# EasyEDA Pro project Complete_project.epro, schematic Schematic4

## Sheets
1 控制: Board Name: control2.0; Create Date: 2025-02-19; Page Name: 控制; Project Name: 煮茶机; Schematic Name: Schematic4; Update Date: 2025-02-22; Company: 嘉立创EDA; Page Size: A4; Version: V1.0
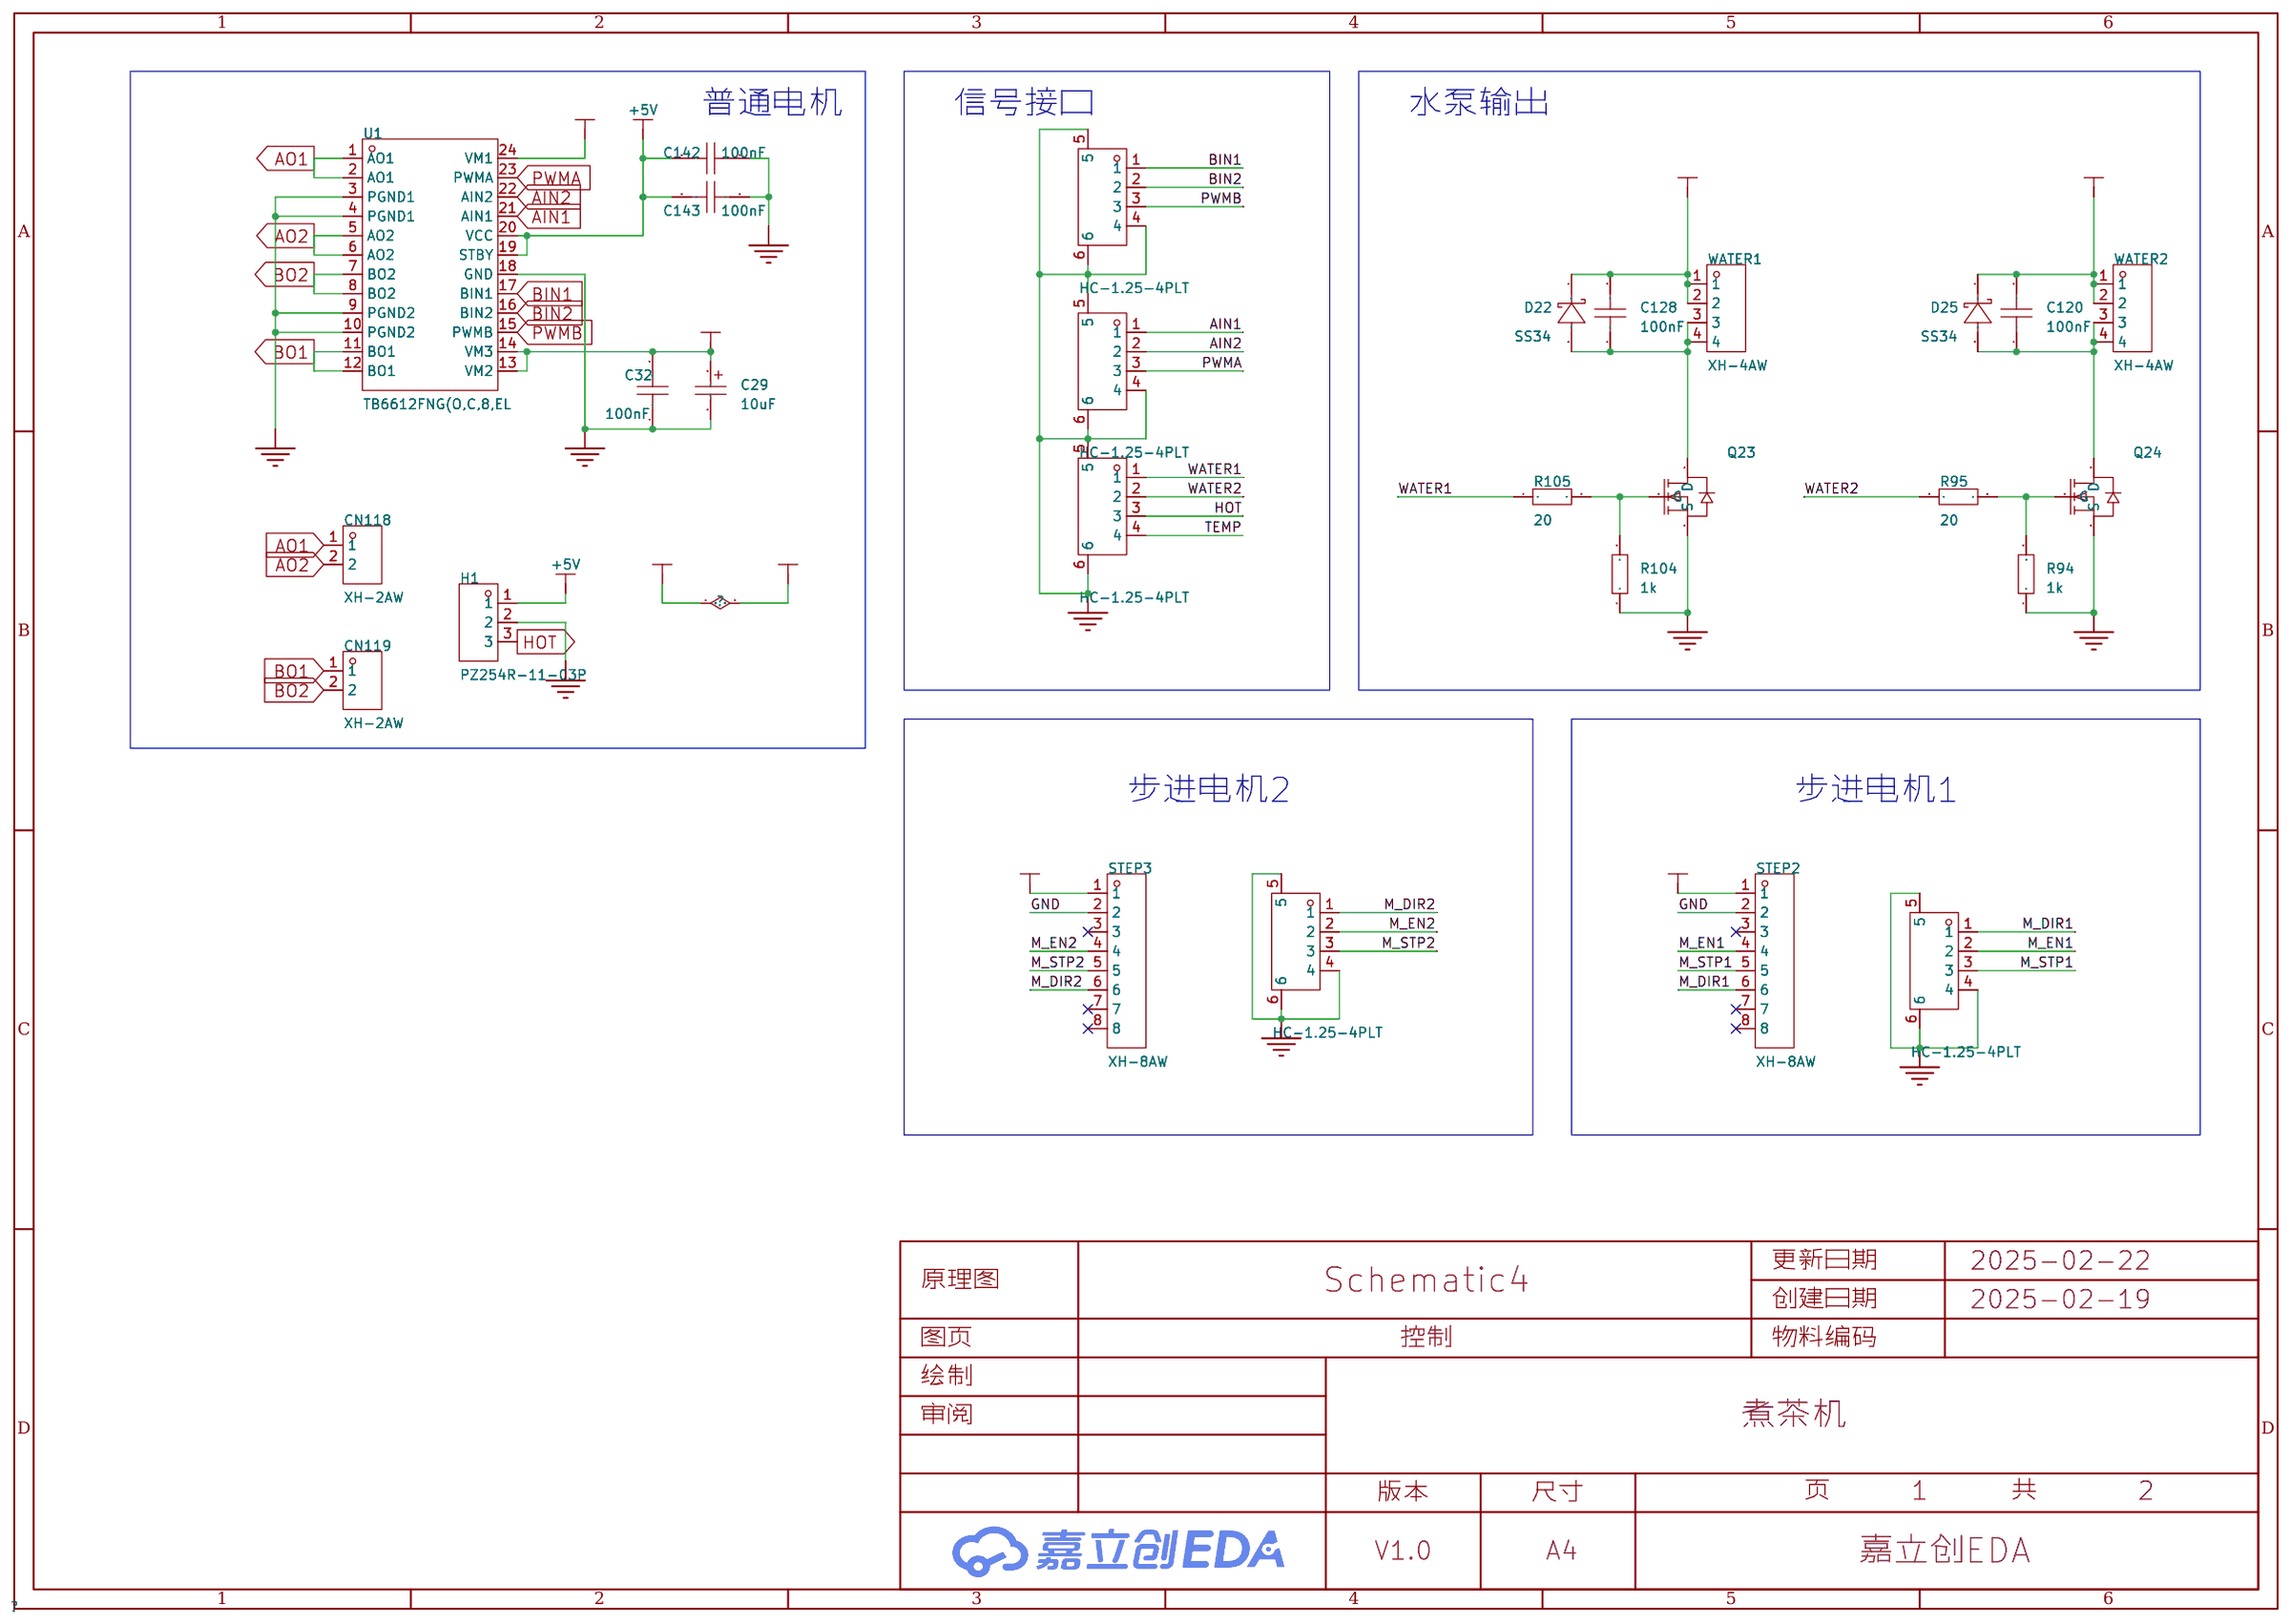
[diagram p5: 控制]
2 电源: Page Name: 电源
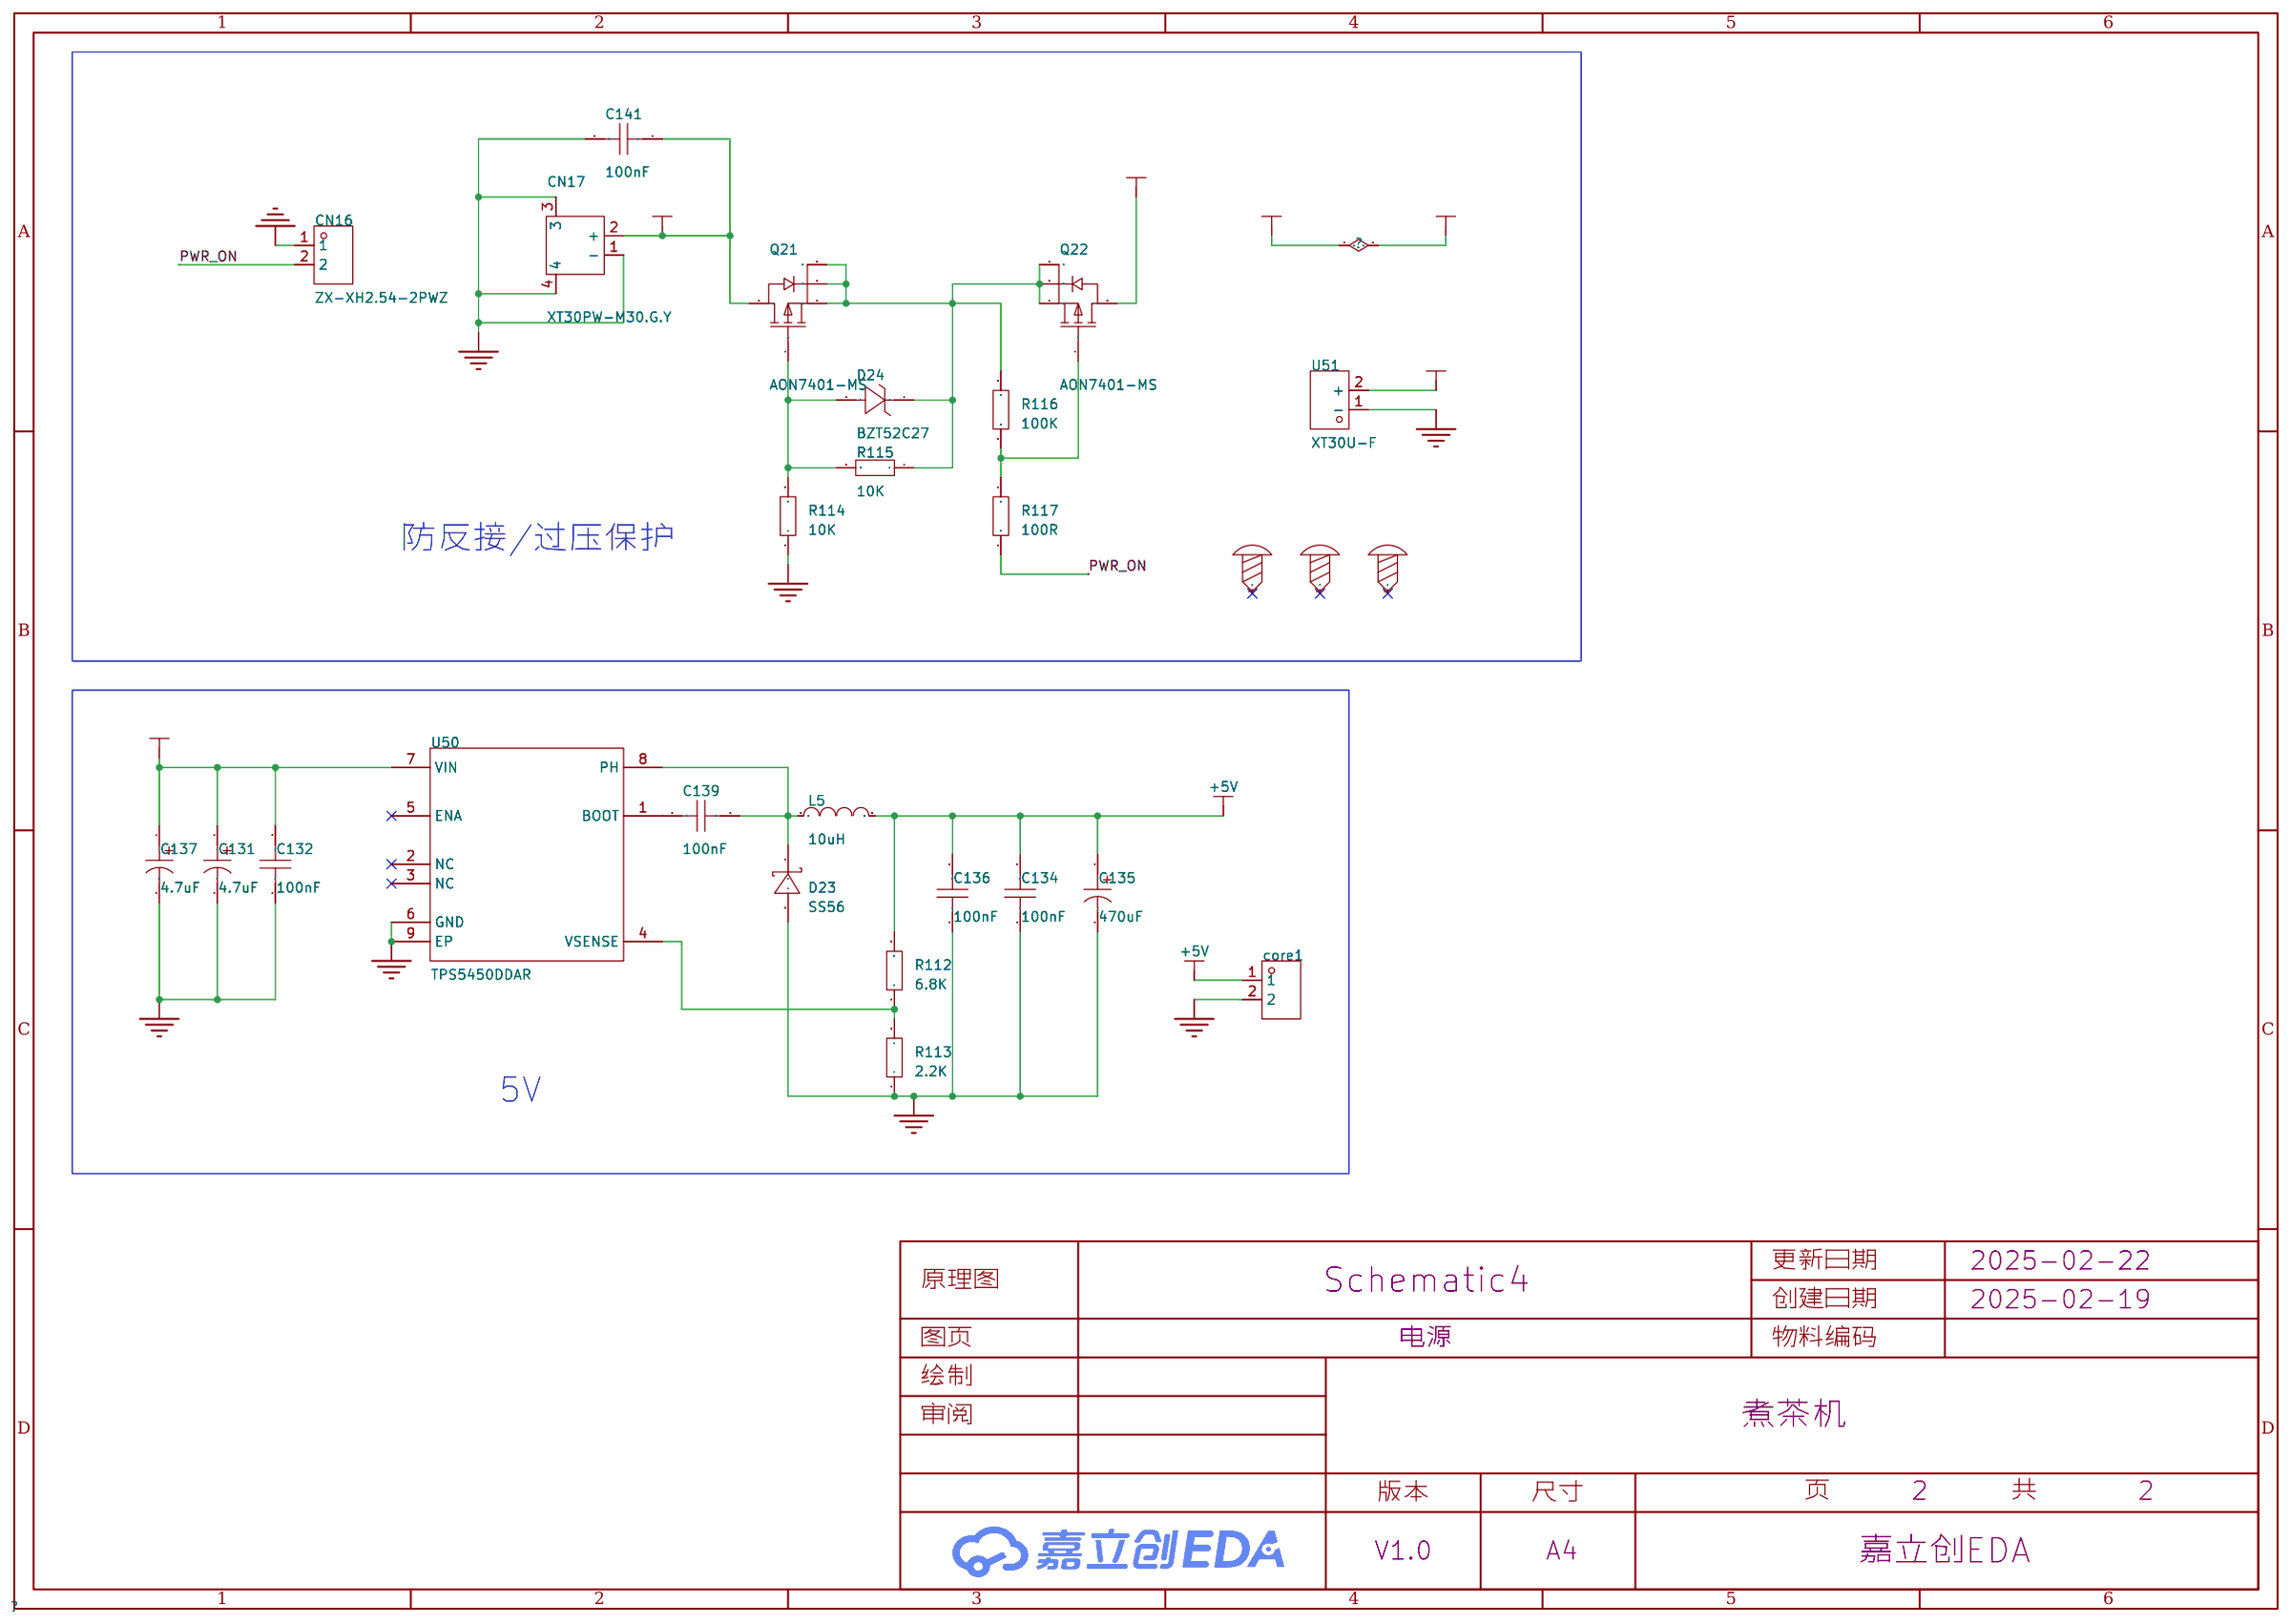
[diagram p6: 电源]

## Parts
sheet 控制
C29  10uF  [CASE-C_6032]
C32  100nF  [C0805]
C120  100nF  [C0805]
C128  100nF  [C0805]
C142  100nF  [C0805]
C143  100nF  [C0805]
CN113  HC-1.25-4PLT  [CONN-SMD_4P-P1.25_HCTL_HC-1.25-4PLT]
CN114  HC-1.25-4PLT  [CONN-SMD_4P-P1.25_HCTL_HC-1.25-4PLT]
CN115  HC-1.25-4PLT  [CONN-SMD_4P-P1.25_HCTL_HC-1.25-4PLT]
CN116  HC-1.25-4PLT  [CONN-SMD_4P-P1.25_HCTL_HC-1.25-4PLT]
CN117  HC-1.25-4PLT  [CONN-SMD_4P-P1.25_HCTL_HC-1.25-4PLT]
CN118  XH-2AW  [CONN-TH_XH-2AW_C2908611]
CN119  XH-2AW  [CONN-TH_XH-2AW_C2908611]
D22  SS34  [SMA_L4.3-W2.5-LS5.0-RD]
D25  SS34  [SMA_L4.3-W2.5-LS5.0-RD]
H1  PZ254R-11-03P  [HDR-TH_3P-P2.54-H-M-W10.4]
Q23  -  [SOT-23-3_L2.9-W1.3-P1.90-LS2.4-BR]
Q24  -  [SOT-23-3_L2.9-W1.3-P1.90-LS2.4-BR]
R94  1k  [R0805]
R95  20  [R0805]
R104  1k  [R0805]
R105  20  [R0805]
STEP2  XH-8AW  [CONN-TH_8P-P2.54_HCTL_XH-8AW_C2908617]
STEP3  XH-8AW  [CONN-TH_8P-P2.54_HCTL_XH-8AW_C2908617]
U1  TB6612FNG(O,C,8,EL  [SSOP-24_L8.4-W5.8-P0.65-LS7.8-BL]
WATER1  XH-4AW  [CONN-TH_XH-4AW]
WATER2  XH-4AW  [CONN-TH_XH-4AW]
sheet 电源
C131  4.7uF  [CAP-SMD_BD4.0-L4.3-W4.3-LS5.0-FD]
C132  100nF  [C0805]
C134  100nF  [C0805]
C135  470uF  [CAP-SMD_BD10.0-L10.3-W10.3-LS11.3-FD]
C136  100nF  [C0805]
C137  4.7uF  [CAP-SMD_BD4.0-L4.3-W4.3-LS5.0-FD]
C139  100nF  [C0805]
C141  100nF  [C1210]
CN16  ZX-XH2.54-2PWZ  [CONN-TH_2P-P2.50_ZX-XH2.54-2PWZ]
CN17  XT30PW-M30.G.Y  [CONN-TH_XT30PW-M]
core1  ZX-XH2.54-2PWZ  [CONN-TH_2P-P2.50_ZX-XH2.54-2PWZ]
D23  SS56  [SMA_L4.3-W2.6-LS5.2-RD]
D24  BZT52C27  [SOD-123_L2.7-W1.6-LS3.7-RD]
L5  10uH  [IND-SMD_L7.3-W6.8]
Q21  AON7401-MS  [POWERDI3333-8_DMN7022LFGQ-7]
Q22  AON7401-MS  [POWERDI3333-8_DMN7022LFGQ-7]
R112  6.8K  [R0805]
R113  2.2K  [R0805]
R114  10K  [R0805]
R115  10K  [R0805]
R116  100K  [R0805]
R117  100R  [R0805]
SCREW1  -  [M2螺丝]
SCREW2  -  [M2螺丝]
SCREW3  -  [M2螺丝]
U50  TPS5450DDAR  [SOP-8_L4.9-W3.9-P1.27-LS6.0-BL-EP]
U51  XT30U-F  [CONN-TH_XT30U-F]

## Library data of the parts
C29 = TAJC106K035RNJ: 容值:10uF;精度:±10%;额定电压:35V;等效串联电阻:1.6Ω@100kHz;; LCSC Part Name: 10uF ±10% 35V; Supplier Part: C7211; Manufacturer: Kyocera AVX; Supplier Footprint: CASE-C-6032; JLCPCB Part Class: 扩展库; Datasheet: https://atta.szlcsc.com/upload/public/pdf/source/20160107/1457707750344.pdf; Supplier: LCSC; Tolerance: ±10%; Rated Voltage: 35V; Equivalent Series Resistance(ESR): 1.6Ω@100kHz; Operating Temperature: -55℃~+125℃
C32 C120 C128 C132 C134 C136 C139 C141-C143 = CAP_0805: Supplier Footprint: 0805
CN113-CN117 = HC-1.25-4PLT: 插针结构:1x4P;间距:1.25mm;安装方式:立贴;参考系列:-;总PIN数:4P;排数:1;每排PIN数:4;行距:-;额定电流:2A;触头材质:黄铜;触头镀层:锡;工作温度范围:-25℃~+85℃;; LCSC Part Name: 1x4P 间距:1.25mm 立贴; Supplier Part: C2845390; Manufacturer: HCTL(华灿天禄); Supplier Footprint: SMD,P=1.25mm; JLCPCB Part Class: 扩展库; Datasheet: https://atta.szlcsc.com/upload/public/pdf/source/20230707/8E5913B5A3195C18F5EE12EA4CB86B82.pdf; Supplier: LCSC; Pins Structure: 1x4P; Pitch: 1.25mm; Mounting Style: 立贴; Number of Pins: 4P; Number of Rows: 1; Number of PINs Per Row: 4; Current Rating (Max): 2A; Contact Material: 黄铜; Contact Plating: 锡; Operating Temperature Range: -25℃~+85℃
CN118 CN119 = XH-2AW_C2908611: 插针结构:1x2P;间距:2.5mm;安装方式:弯插;参考系列:XH;总PIN数:2P;排数:1;每排PIN数:2;行距:-;额定电流:3A;触头材质:黄铜;触头镀层:锡;工作温度范围:-25℃~+85℃;; LCSC Part Name: 1x2P 间距:2.5mm 弯插 系列:XH; Supplier Part: C2908611; Manufacturer: HCTL(华灿天禄); Supplier Footprint: 弯插,P=2.5mm; JLCPCB Part Class: 扩展库; Datasheet: https://atta.szlcsc.com/upload/public/pdf/source/20230711/B565BAF3B11666EF6B81B3605408F2BD.pdf; Supplier: LCSC; Pins Structure: 1x2P; Pitch: 2.5mm; Mounting Style: 弯插; Reference Series: XH; Number of Pins: 2P; Number of Rows: 1; Number of PINs Per Row: 2; Current Rating (Max): 3A; Contact Material: 黄铜; Contact Plating: 锡; Operating Temperature Range: -25℃~+85℃
D22 D25 = SS34_C727060: 二极管配置:独立式;正向压降(Vf):550mV@3A;直流反向耐压(Vr):40V;平均整流电流(Io):3A;; LCSC Part Name: 电压:40V 电流:3A; Supplier Part: C727060; Manufacturer: TWGMC(台湾迪嘉); Supplier Footprint: SMA(DO-214AC); JLCPCB Part Class: 扩展库; Datasheet: https://atta.szlcsc.com/upload/public/pdf/source/20200828/C727059_6599B6CAC5F3238B9C33E46794659DBE.pdf; Supplier: LCSC; Diode Configuration: 独立式; Forward Voltage (Vf@If): 550mV@3A; Reverse Voltage (Vr): 40V; Average Rectified Current (Io): 3A; Reverse Leakage Current (Ir): 500uA@40V
H1 = PZ254R-11-03P: 插针结构:1x3P;间距:2.54mm;行距:-;圆针/方针:方针;安装类型:弯插;排数:单排;总PIN位数:3P;额定电流:-;额定电压:-;配合针长度:6mm;塑高:2.5mm;触头材质:黄铜;触头镀层:-;工作温度范围:-40℃~+105℃;颜色:黑色;; LCSC Part Name: 间距:2.54mm 1x3P 弯插 方针; Supplier Part: C492411; Manufacturer: XFCN(兴飞); Supplier Footprint: 弯插,P=2.54mm; JLCPCB Part Class: 扩展库; Datasheet: https://atta.szlcsc.com/upload/public/pdf/source/20200309/C492411_5256E8AAA7569F6D33B6ADBFAE4F2888.pdf; Supplier: LCSC; Pin Structure: 1x3P; Pitch: 2.54mm; Circluar Pins/Square Pins: 方针; Mounting Type: 弯插; Number of Rows: 单排; Number of Pins: 3P; Length of Mating Pin: 6mm; Insulation Height: 2.5mm; Contact Material: 黄铜; Operating Temperature Range: -40℃~+105℃; Color: 黑色
Q23 Q24 = AO3400A_N: 类型:N沟道;漏源电压(Vdss):30V;连续漏极电流(Id):5.2A;功率(Pd):1W;导通电阻(RDS(on)@Vgs,Id):35mΩ@10V,5A;阈值电压(Vgs(th)@Id):1.5V@250μA;; Supplier Footprint: SOT-23; Supplier Part: C700953
R94 R95 R104 R105 R112-R117 = Res_0805: Supplier Footprint: 0805
STEP2 STEP3 = XH-8AW: 插针结构:1x8P;间距:2.5mm;安装方式:弯插;参考系列:XH;总PIN数:8P;排数:1;每排PIN数:8;行距:-;额定电流:3A;触头材质:黄铜;触头镀层:锡;工作温度范围:-25℃~+85℃;; LCSC Part Name: 1x8P 间距:2.5mm 弯插 系列:XH; Supplier Part: C2908617; Manufacturer: HCTL(华灿天禄); Supplier Footprint: 弯插,P=2.5mm; JLCPCB Part Class: 扩展库; Datasheet: https://atta.szlcsc.com/upload/public/pdf/source/20230711/B565BAF3B11666EF6B81B3605408F2BD.pdf; Supplier: LCSC; Pins Structure: 1x8P; Pitch: 2.5mm; Mounting Style: 弯插; Reference Series: XH; Number of Pins: 8P; Number of Rows: 1; Number of PINs Per Row: 8; Current Rating (Max): 3A; Contact Material: 黄铜; Contact Plating: 锡; Operating Temperature Range: -25℃~+85℃
U1 = TB6612FNG(O,C,8,EL: 双直流电机驱动器集成电路; Supplier Part: C88224; Manufacturer: TOSHIBA(东芝); Supplier Footprint: SSOP-24-208mil; JLCPCB Part Class: 扩展库; Datasheet: https://atta.szlcsc.com/upload/public/pdf/source/20171128/C141517_15118625624231147036.pdf; Supplier: LCSC
WATER1 WATER2 = XH-4AW: 插针结构:1x4P;间距:2.54mm;安装方式:弯插;参考系列:XH;总PIN数:4P;排数:1;每排PIN数:4;行距:-;额定电流:3A;触头材质:黄铜;触头镀层:锡;工作温度范围:-25℃~+85℃;; LCSC Part Name: 1x4P 间距:2.54mm 弯插 系列:XH; Supplier Part: C2908613; Manufacturer: HCTL(华灿天禄); Supplier Footprint: 弯插,P=2.5mm; JLCPCB Part Class: 扩展库; Datasheet: https://atta.szlcsc.com/upload/public/pdf/source/20230711/B565BAF3B11666EF6B81B3605408F2BD.pdf; Supplier: LCSC; Pins Structure: 1x4P; Pitch: 2.54mm; Mounting Style: 弯插; Reference Series: XH; Number of Pins: 4P; Number of Rows: 1; Number of PINs Per Row: 4; Current Rating (Max): 3A; Contact Material: 黄铜; Contact Plating: 锡; Operating Temperature Range: -25℃~+85℃
C131 C137 = VT4.7UF50V167RV0133: 容值:4.7uF;精度:±20%;额定电压:50V;纹波电流:15mA@120Hz;等效串联电阻:-;; LCSC Part Name: 4.7uF ±20% 50V; Supplier Part: C5246584; Manufacturer: KNSCHA(科尼盛); Supplier Footprint: SMD,D4xL5.4mm; JLCPCB Part Class: 扩展库; Datasheet: https://atta.szlcsc.com/upload/public/pdf/source/20221104/28D100275C90741A69E4DC1F6F9A3749.pdf; Supplier: LCSC; Tolerance: ±20%; Rated Voltage: 50V; Ripple Current: 15mA@120Hz; φD: 4mm; L: 5.4mm; Lifetime @ Temp: 2000hrs@105℃; Operating Temperature: -55℃~+105℃
C135 = RVT1E471M1010 470UF 25V: 容值:470uF;精度:±20%;额定电压:25V;纹波电流:286mA@120Hz;等效串联电阻:-;; LCSC Part Name: 470uF ±20% 25V; Supplier Part: C970707; Manufacturer: DMBJ(振宝佳); Supplier Footprint: SMD,D10xL10.2mm; JLCPCB Part Class: Extended Part; Datasheet: https://atta.szlcsc.com/upload/public/pdf/source/20201217/C970594_282EC4D70669AEE33806F6C24A5FAA0B.pdf; Supplier: LCSC; Tolerance: ±20%; Rated Voltage: 25V; Ripple Current: 286mA@120Hz; φD: 10mm; L: 10.2mm; Lifetime @ Temp: 2800hrs@105℃; Operating Temperature: -55℃~+105℃
CN16 core1 = ZX-XH2.54-2PWZ: 插针结构:1x2P;间距:2.54mm;安装方式:弯插;参考系列:XH;总PIN数:2P;排数:1;每排PIN数:2;行距:-;额定电流:3A;触头材质:黄铜;触头镀层:锡;工作温度范围:-25℃~+85℃;; Supplier Part: C7429641; Manufacturer: Megastar(兆星); Supplier Footprint: 弯插,P=2.54mm; JLCPCB Part Class: 扩展库; Datasheet: https://atta.szlcsc.com/upload/public/pdf/source/20230619/56AE8F2E01CDFEAA97FC89B5ED558AB5.pdf; Supplier: LCSC; Pins Structure: 1x2P; Pitch: 2.54mm; Mounting Style: 弯插; Reference Series: XH; Number of Pins: 2P; Number of Rows: 1; Number of PINs Per Row: 2; Current Rating (Max): 3A; Contact Material: 黄铜; Contact Plating: 锡; Operating Temperature Range: -25℃~+85℃
CN17 = XT30PW-M30.G.Y: 类别:-;类型1:-;; LCSC Part Name: AMASS(艾迈斯)航模插头 卧式弯脚 XT30PW-M公头; Supplier Part: C431092; Manufacturer: AMASS(艾迈斯); JLCPCB Part Class: 扩展库; Datasheet: https://atta.szlcsc.com/upload/public/pdf/source/20220222/6A9F22F7850E25B33E1BE430ADF8560B.pdf; Supplier: LCSC; Type: 航模插头; RatedVoltage: DC 500V; InterfaceType: 公头; RatedCurrent: 15A; RecommendedWireGauge: 16/18/20AWG; contact resistance: 1.2mΩ; specifications: 2pin
D23 = SS56_C65009: 二极管配置:独立式;正向压降(Vf):700mV@5A;直流反向耐压(Vr):60V;整流电流:5A;; LCSC Part Name: 电压:60V 电流:5A; Supplier Part: C65009; Manufacturer: MDD(辰达半导体); Supplier Footprint: SMA(DO-214AC); JLCPCB Part Class: 扩展库; Datasheet: https://atta.szlcsc.com/upload/public/pdf/source/20230314/529CD85F9B31F69841D3A079BC07E377.pdf; Supplier: LCSC; Diode Configuration: 独立式; Forward Voltage (Vf@If): 700mV@5A; Reverse Voltage (Vr): 60V; Rectified Current: 5A; Reverse Leakage Current (Ir): 1mA@60V
D24 = BZT52C27_C19077417: 二极管配置:独立式;稳压值(标称值):27V;稳压值(范围):25.65V~28.35V;功率(Pd):300mW;; Supplier Part: C19077417; Manufacturer: 宏迦橙; Supplier Footprint: SOD-123; JLCPCB Part Class: 扩展库; Datasheet: https://atta.szlcsc.com/upload/public/pdf/source/20231025/04C236D016943CCCD8EB2CC43C101E31.pdf; Supplier: LCSC; Diode Configuration: 独立式; Zener Voltage (Nom): 27V; Reverse Leakage Current (Ir): 100nA@18.9V; Zener Voltage (Range): 25.65V~28.35V; Power Dissipation: 300mW; Zener Impedance (Zzt): 80Ω
L5 = FXL0630-100-M: 电感值:10uH;精度:±20%;额定电流:4.5A;饱和电流(Isat):5.5A;类型:一体成型电感;; LCSC Part Name: 10uH ±20% 5.5A; Supplier Part: C167223; Manufacturer: cjiang(长江微电); Supplier Footprint: SMD,6.6x7mm; JLCPCB Part Class: 扩展库; Datasheet: https://atta.szlcsc.com/upload/public/pdf/source/20240426/3189EA8206330E2108542F9E34E540E7.pdf; Supplier: LCSC; Tolerance: ±20%; Rated Current: 4.5A; Saturation Current (Isat): 5.5A; DC Resistance (DCR): 68mΩ; Type: 一体成型电感
Q21 Q22 = AON7401-MS: 类型:1个P沟道;漏源电压(Vdss):30V;连续漏极电流(Id):50A;导通电阻(RDS(on)@Vgs,Id):13mΩ@10V;阈值电压(Vgs(th)@Id):2.5V;; LCSC Part Name: 1个P沟道 耐压:30V 电流:50A; Supplier Part: C17702935; Manufacturer: MSKSEMI(美森科); Supplier Footprint: DFN3x3-8L; JLCPCB Part Class: 扩展库; Datasheet: https://atta.szlcsc.com/upload/public/pdf/source/20230927/4A8DE91060F4732D15B0B926858E3411.pdf; Supplier: LCSC; Type: 1个P沟道; Drain Source Voltage (Vdss): 30V; Continuous Drain Current (Id): 50A; Drain Source On Resistance (RDS(on)@Vgs,Id): 13mΩ@10V; Gate Threshold Voltage (Vgs(th)@Id): 2.5V
SCREW1-SCREW3 = M2螺丝: Supplier Footprint: 插件
U50 = TPS5450DDAR: 功能类型:降压型;输出类型:可调;输入电压:5.5V~36V;输出电压:1.221V~31.32V;输出电流(最大值):5A;; Supplier Part: C114425; Manufacturer: TI(德州仪器); Supplier Footprint: SOP-8-EP-150mil; JLCPCB Part Class: 扩展库; Datasheet: https://www.ti.com/cn/lit/gpn/tps5450; Supplier: LCSC; Function: 降压型; Output Type: 可调; Input Voltage: 5.5V~36V; Output Voltage: 1.221V~31.32V; Output Current (Max): 5A; Switching Frequency: 500kHz; Operating Temperature: -40℃~+125℃@(TJ); Synchronous Rectification: 否; Number of Outputs: 1; Topology: 降压式; Switch tube (built-in/external): 内置
U51 = XT30U-F: 类别:-;类型1:-;; LCSC Part Name: AMASS(艾迈斯)轻量版锂电池插头母头 XT30U-F; Supplier Part: C99102; Manufacturer: AMASS(艾迈斯); JLCPCB Part Class: 扩展库; Datasheet: https://atta.szlcsc.com/upload/public/pdf/source/20190916/C428721_B0ECB8C5937139CEFE8736D2D3175B0E.pdf; Supplier: LCSC; Brand: 艾迈斯; Type: 插头; Colour: 黄色; InterfaceType: 母头

## Nets
+5V: C134.2 C135.1 C136.2 C142.2 C143.2 core1.1 H1.1 L5.2 R112.2 U1.19(STBY) U1.20(VCC)
+12V: C29.1 C32.2 C120.2 C128.2 C131.1 C132.2 C137.1 D22.1(C) D25.1(C) Q22.5(D) STEP2.1 STEP3.1 U1.13(VM2) U1.14(VM3) U1.24(VM1) U50.7(VIN) U51.2(+) WATER1.1 WATER1.2 WATER2.1 WATER2.2
GND: C29.2 C32.1 C131.2 C132.1 C134.1 C135.2 C136.1 C137.2 C141.2 C142.1 C143.1 CN16.1 CN17.1(-) CN17.3 CN17.4 CN113.5 CN113.6 CN114.4 CN114.5 CN114.6 CN115.4 CN115.5 CN115.6 CN116.4 CN116.5 CN116.6 CN117.4 CN117.5 CN117.6 core1.2 D23.2(A) H1.2 Q23.2(S) Q24.2(S) R94.1 R104.1 R113.1 R114.1 STEP2.2 STEP3.2 U1.3(PGND1) U1.4(PGND1) U1.9(PGND2) U1.10(PGND2) U1.18(GND) U50.6(GND) U50.9(EP) U51.1(-)
AIN1: CN114.1 U1.21(AIN1)
AIN2: CN114.2 U1.22(AIN2)
AO1: CN118.1 U1.1(AO1) U1.2(AO1)
AO2: CN118.2 U1.5(AO2) U1.6(AO2)
BIN1: CN115.1 U1.17(BIN1)
BIN2: CN115.2 U1.16(BIN2)
BO1: CN119.1 U1.11(BO1) U1.12(BO1)
BO2: CN119.2 U1.7(BO2) U1.8(BO2)
HOT: CN113.3 H1.3
INPUT: C141.1 CN17.2(+) Q21.5(D)
M_DIR1: CN116.1 STEP2.6
M_DIR2: CN117.1 STEP3.6
M_EN1: CN116.2 STEP2.4
M_EN2: CN117.2 STEP3.4
M_STP1: CN116.3 STEP2.5
M_STP2: CN117.3 STEP3.5
PWMA: CN114.3 U1.23(PWMA)
PWMB: CN115.3 U1.15(PWMB)
PWR_ON: CN16.2 R117.2
TEMP: CN113.4
WATER1: CN113.1 R105.1
WATER2: CN113.2 R95.1
$1N1334: Q24.1(G) R94.2 R95.2
$1N1335: Q23.1(G) R104.2 R105.2
$1N1337: C128.1 D22.2(A) Q23.3(D) WATER1.3 WATER1.4
$1N1338: C120.1 D25.2(A) Q24.3(D) WATER2.3 WATER2.4
$2N1103: D24.2(A) Q21.4(G) R114.2 R115.2
$2N1105: D24.1(K) Q21.1(S) Q21.2(S) Q21.3(S) Q22.1(S) Q22.2(S) Q22.3(S) R115.1 R116.1
$2N1113: Q22.4(G) R116.2 R117.1
$2N1120: R112.1 R113.2 U50.4(VSENSE)
$2N1124: C139.2 D23.1(K) L5.1 U50.8(PH)
$2N1125: C139.1 U50.1(BOOT)

Not connected (* = marked no-connect by the designer): SCREW1 1*; SCREW2 1*; SCREW3 1*; STEP2 3* 7* 8*; STEP3 3* 7* 8*; U50 2(NC)* 3(NC)* 5(ENA)*

## Notes on the sheets
sheet 1
- 普通电机
- 信号接口
- 水泵输出
- 步进电机2
- 步进电机1
sheet 2
- 防反接/过压保护
- 5V
